# Altium project MB1428.PrjPcb (part 4 of 4)

## Sheet BUCK_BOOST_Converter.SchDoc: BUCK_BOOST_Converter
size A3; Date: Not used; ApprovedBy: Not used; CheckedBy: Not used; Author: Not used; CompanyName: STMicroelectronics; DrawnBy: Not used; Engineer: Not used; Organization: Not used; Address1: Not used; Address2: Not used; Address3: Not used; Address4: Not used; DocumentNumber: Not used; Revision: Not used; SheetNumber: 7; SheetTotal: 12; CurrentTime: Not used; CurrentDate: Not used; Time: Not used; DocumentFullPathAndName: Not used; DocumentName: Not used; ModifiedDate: Not used; ImagePath: Not used; ProjectName: Not used; Application_BuildNumber: Not used
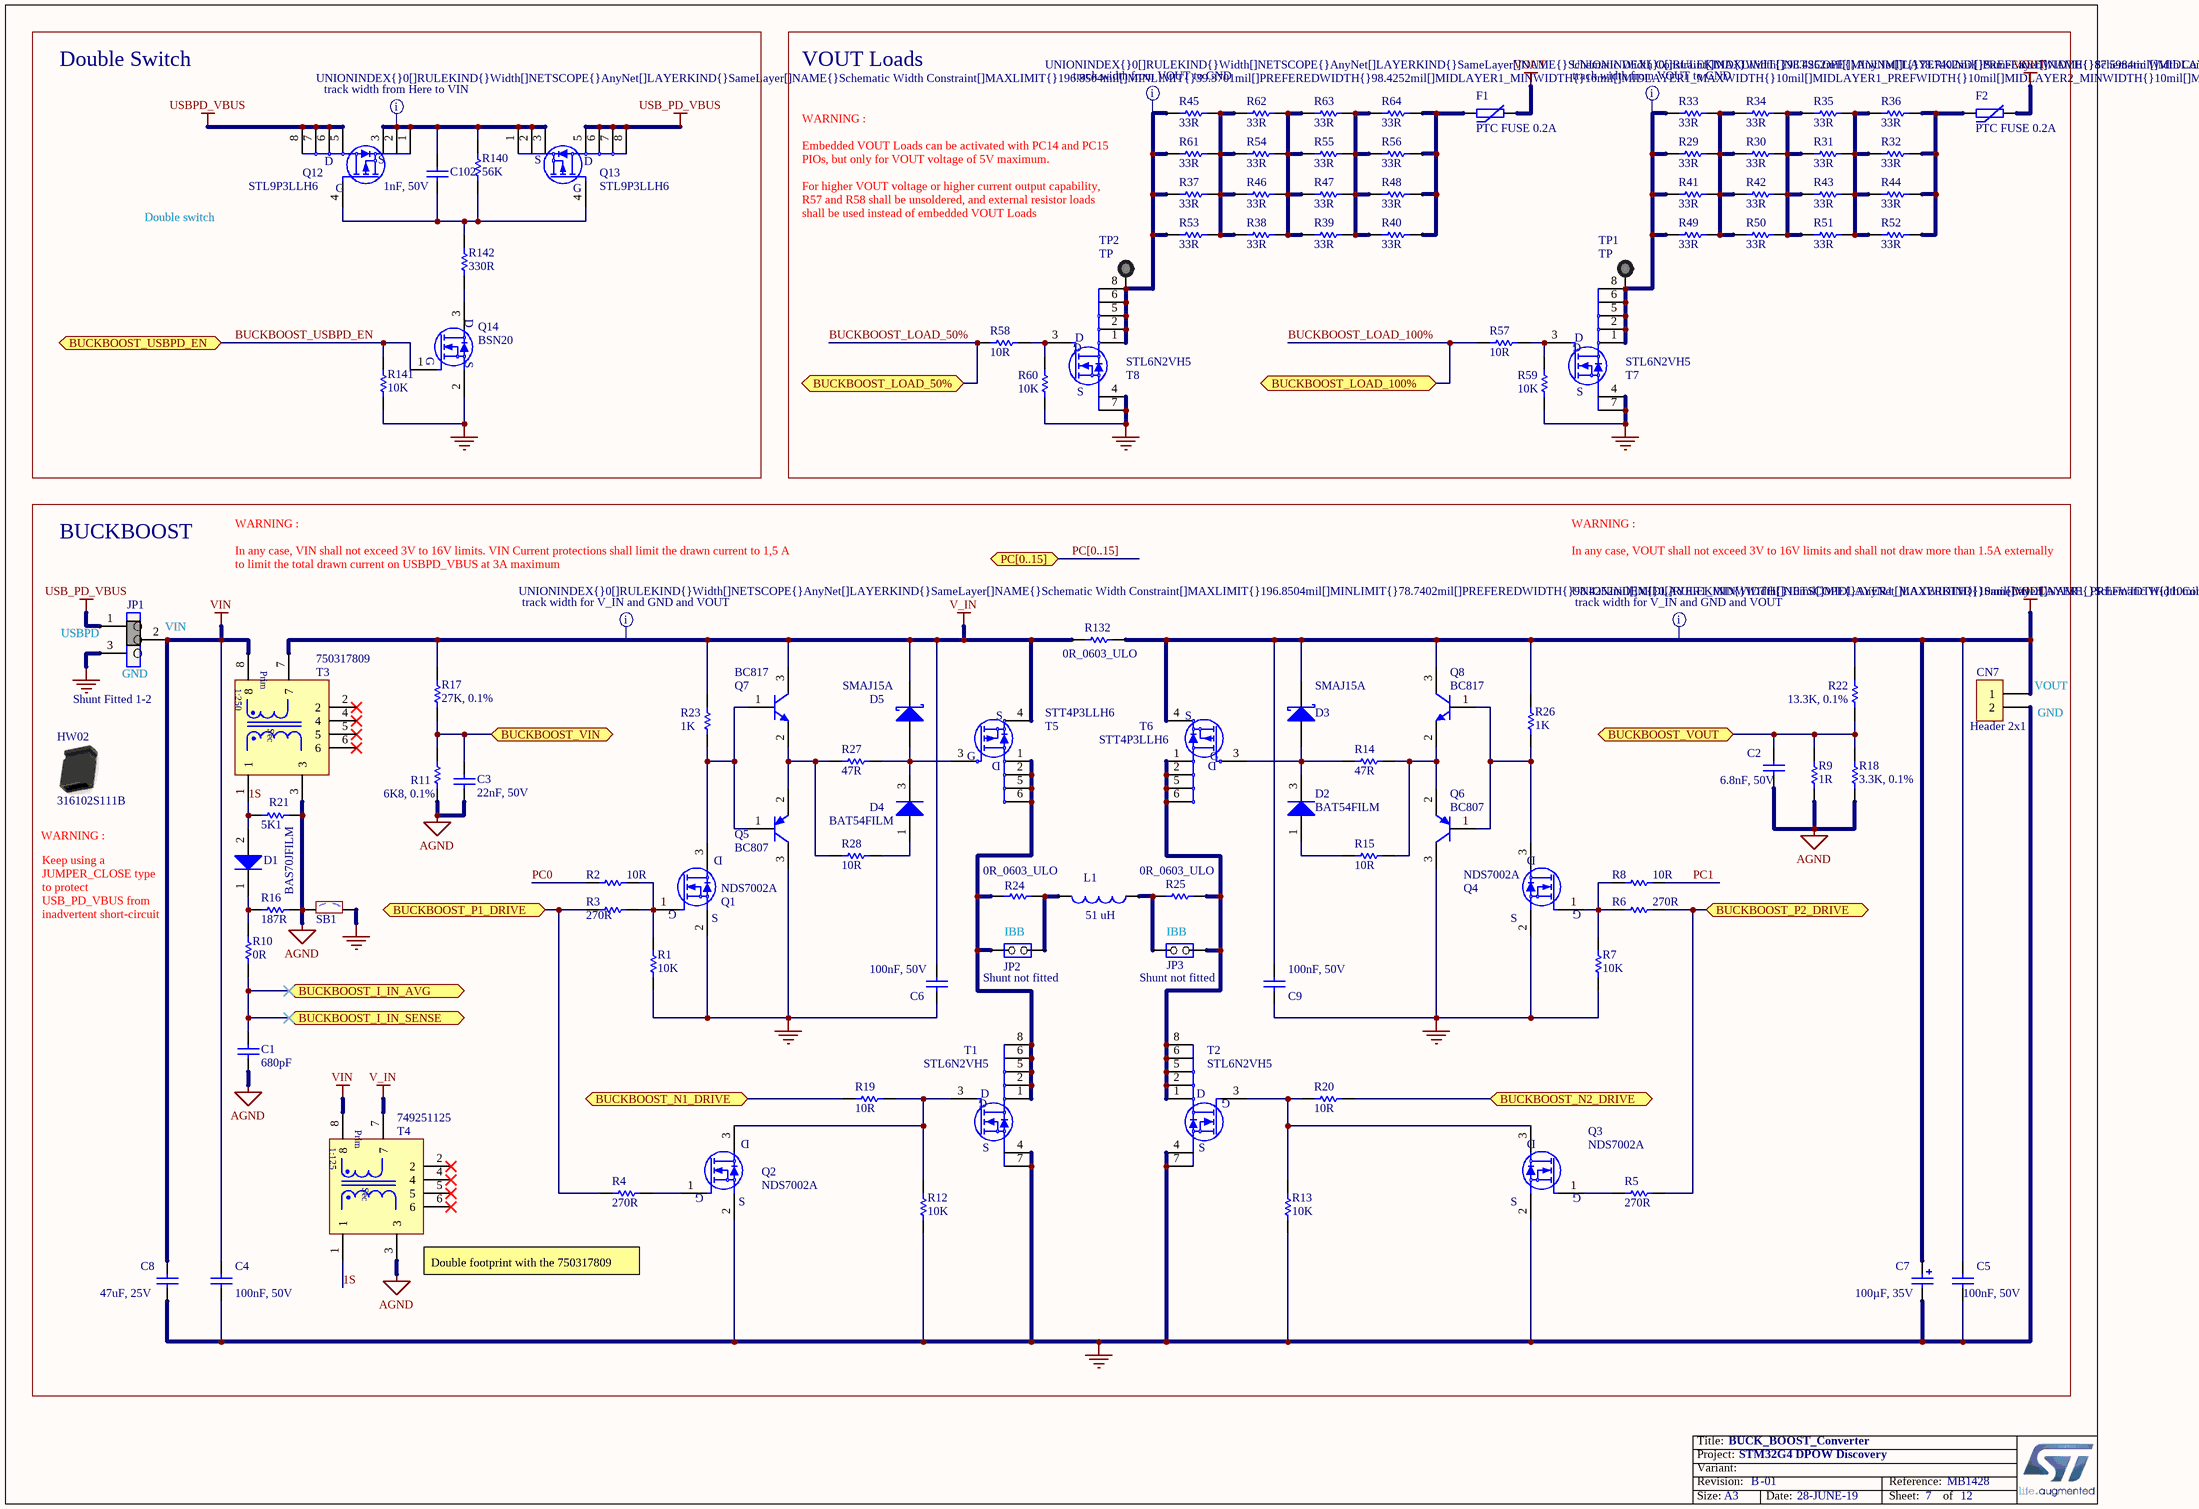
[diagram p10: BUCK_BOOST_Converter.SchDoc]

### Parts
C1  value 680pF  [C0603_H0P8]
C2  value 6.8nF, 50V  [C0603_H0P8]
C3  value 22nF, 50V  [C0603]
C4  value 100nF, 50V  [C0805_H0P85]
C5  value 100nF, 50V  [C0805_H0P85]
C6  value 100nF, 50V  [C0805_H0P85]
C7  value 100µF, 35V  [CPOL_WURTH_WCAP-ASLL_8X10P5]
C8  value 47uF, 25V  [C1206_H1P6]  (hidden comment: Capacitor)
C9  value 100nF, 50V  [C0805_H0P85]
C102  value 1nF, 50V  [C0805_H0P6]
CN7  Header 2x1  [CON_LYCONN_313102S141346]
D1  value BAS70JFILM  [DIO_SOD323_1K_2A]  (hidden comment: DIODE_1K_2A)
D2  value BAT54FILM  [DIO_SOT23_SC59_1A_2NC_3K_H1P4]
D3  value SMAJ15A  [DIO_SMA_1A_2K]
D4  value BAT54FILM  [DIO_SOT23_SC59_1A_2NC_3K_H1P4]
D5  value SMAJ15A  [DIO_SMA_1A_2K]
F1  value PTC FUSE 0.2A  [PTC_EATON_FUSE_PTS1812_H0P9]
F2  value PTC FUSE 0.2A  [PTC_EATON_FUSE_PTS1812_H0P9]
HW02  value 316102S111B  (hidden comment: JUMPER_CLOSE)
JP1  value Shunt Fitted 1-2  [CON_SAMTEC_TSW-103-07-F-S]  (hidden comment: Jumper_Header 3x1 Fitted 1-2)
JP2  value Shunt not fitted  [CON_988-JIUBABA_313102S111116]  (hidden comment: Jumper_Header 2x1)
JP3  value Shunt not fitted  [CON_988-JIUBABA_313102S111116]  (hidden comment: Jumper_Header 2x1)
L1  value 51 uH  [IND_SUNLORD_SWPA5040S]  (hidden comment: Inductor)
Q1  value NDS7002A  [ICC_SOT23-3L_H1P12]
Q2  value NDS7002A  [ICC_SOT23-3L_H1P12]
Q3  value NDS7002A  [ICC_SOT23-3L_H1P12]
Q4  value NDS7002A  [ICC_SOT23-3L_H1P12]
Q5  value BC807  [ICC_SOT23-3L_H1P12]
Q6  value BC807  [ICC_SOT23-3L_H1P12]
Q7  value BC817  [NPN_SOT23]
Q8  value BC817  [NPN_SOT23]
Q12  value STL9P3LLH6  [MOS_POWERFLAT_3P3X3P3_P065]
Q13  value STL9P3LLH6  [MOS_POWERFLAT_3P3X3P3_P065]
Q14  value BSN20  [MOS_SOT23]
R1  value 10K  [R0805]
R2  value 10R  [R0805_H0P5]
R3  value 270R  [R0805_H0P5]
R4  value 270R  [R0805_H0P5]
R5  value 270R  [R0805_H0P5]
R6  value 270R  [R0805_H0P5]
R7  value 10K  [R0805]
R8  value 10R  [R0805_H0P5]
R9  value 1R  [R1206_H0P55]
R10  value 0R  [R0603]  (hidden comment: Resistor)
R11  value 6K8, 0.1%  [R0805]
R12  value 10K  [R0805]
R13  value 10K  [R0805]
R14  value 47R  [R0805_H0P5]
R15  value 10R  [R0805_H0P5]
R16  value 187R  [R1206_H0P55]  (hidden comment: Resistor)
R17  value 27K, 0.1%  [R0805]
R18  value 3.3K, 0.1%  [R0805]
R19  value 10R  [R0805_H0P5]
R20  value 10R  [R0805_H0P5]
R21  value 5K1  [R0603]  (hidden comment: Resistor)
R22  value 13.3K, 0.1%  [R0805]
R23  value 1K  [R0603]
R24  value 0R_0603_ULO  [R0603]
R25  value 0R_0603_ULO  [R0603]
R26  value 1K  [R0603]
R27  value 47R  [R0805_H0P5]
R28  value 10R  [R0805_H0P5]
R29  value 33R  [R1206_H0P55]
R30  value 33R  [R1206_H0P55]
R31  value 33R  [R1206_H0P55]
R32  value 33R  [R1206_H0P55]
R33  value 33R  [R1206_H0P55]
R34  value 33R  [R1206_H0P55]
R35  value 33R  [R1206_H0P55]
R36  value 33R  [R1206_H0P55]
R37  value 33R  [R1206_H0P55]
R38  value 33R  [R1206_H0P55]
R39  value 33R  [R1206_H0P55]
R40  value 33R  [R1206_H0P55]
R41  value 33R  [R1206_H0P55]
R42  value 33R  [R1206_H0P55]
R43  value 33R  [R1206_H0P55]
R44  value 33R  [R1206_H0P55]
R45  value 33R  [R1206_H0P55]
R46  value 33R  [R1206_H0P55]
R47  value 33R  [R1206_H0P55]
R48  value 33R  [R1206_H0P55]
R49  value 33R  [R1206_H0P55]
R50  value 33R  [R1206_H0P55]
R51  value 33R  [R1206_H0P55]
R52  value 33R  [R1206_H0P55]
R53  value 33R  [R1206_H0P55]
R54  value 33R  [R1206_H0P55]
R55  value 33R  [R1206_H0P55]
R56  value 33R  [R1206_H0P55]
R57  value 10R  [R0805_H0P5]
R58  value 10R  [R0805_H0P5]
R59  value 10K  [R0603]
R60  value 10K  [R0603]
R61  value 33R  [R1206_H0P55]
R62  value 33R  [R1206_H0P55]
R63  value 33R  [R1206_H0P55]
R64  value 33R  [R1206_H0P55]
R132  value 0R_0603_ULO  [R0603]
R140  value 56K  [R0603]
R141  value 10K  [R0603]
R142  value 330R  [R0603]
SB1  (no value)  [SOLDER-BRIDGE_R0603-0R]
T1  value STL6N2VH5  [MOS_POWERFLAT_2X2_P065]
T2  value STL6N2VH5  [MOS_POWERFLAT_2X2_P065]
T3  value 750317809  [TRS_WURTH_750317809]
T4  value 749251125  [TRS_WURTH_749251125]
T5  value STT4P3LLH6  [MOS_SOT23-6L]
T6  value STT4P3LLH6  [MOS_SOT23-6L]
T7  value STL6N2VH5  [MOS_POWERFLAT_2X2_P065]
T8  value STL6N2VH5  [MOS_POWERFLAT_2X2_P065]
TP1  value TP  [TP_PTH_1MM_2MM]
TP2  value TP  [TP_PTH_1MM_2MM]

### Blocks framed on the sheet
Double Switch: C102 Q12-Q14 R140-R142
VOUT Loads: F1 F2 R29-R64 T7 T8 TP1 TP2
BUCKBOOST: C1-C9 CN7 D1-D5 HW02 JP1-JP3 L1 Q1-Q8 R1-R28 R132 SB1 T1-T6

### Ports
BUCKBOOST_I_IN_AVG, BUCKBOOST_I_IN_SENSE, BUCKBOOST_LOAD_50%, BUCKBOOST_LOAD_100%, BUCKBOOST_N1_DRIVE, BUCKBOOST_N2_DRIVE, BUCKBOOST_P1_DRIVE, BUCKBOOST_P2_DRIVE, BUCKBOOST_USBPD_EN, BUCKBOOST_VIN, BUCKBOOST_VOUT, PC[0..15] (bidir)

### Nets
AGND: C1.1 C2.1 C3.1 R9.1 R11.1 R16.2 R18.1 R21.2 SB1.1 T3.3 T4.3
GND: C4.1 C5.1 C6.1 C7.2 C8.1 C9.1 CN7.2 JP1.3 Q1.2(S) Q2.2(S) Q3.2(S) Q4.2(S) Q5.3(C) Q6.3(C) Q14.2(S) R1.1 R7.1 R12.1 R13.1 R59.1 R60.1 R141.1 SB1.2 T1.4(S) T1.7(S) T2.4(S) T2.7(S) T7.4(S) T7.7(S) T8.4(S) T8.7(S)
USB_PD_VBUS: JP1.1 Q13.5(D) Q13.6(D) Q13.7(D) Q13.8(D)
USBPD_VBUS: Q12.5(D) Q12.6(D) Q12.7(D) Q12.8(D)
V_IN: C6.2 D5.2(K) Q7.3(C) R17.2 R23.2 R132.1 T3.7 T4.7 T5.4(S)
VIN: C4.2 C8.2 JP1.2 T3.8 T4.8
VOUT: C5.2 C7.1 C9.2 CN7.1 D3.2(K) F1.2 F2.2 Q8.3(C) R22.2 R26.2 R132.2 T6.4(S)
1S: D1.2(A) R21.1 T3.1 T4.1
BUCKBOOST_I_IN_AVG: C1.2 R10.1 ; port BUCKBOOST_I_IN_AVG, port BUCKBOOST_I_IN_SENSE
BUCKBOOST_LOAD_50%: R58.1 ; port BUCKBOOST_LOAD_50%
BUCKBOOST_LOAD_100%: R57.1 ; port BUCKBOOST_LOAD_100%
BUCKBOOST_N1_DRIVE: R19.1 ; port BUCKBOOST_N1_DRIVE
BUCKBOOST_N2_DRIVE: R20.2 ; port BUCKBOOST_N2_DRIVE
BUCKBOOST_P1_DRIVE: R3.1 R4.1 ; port BUCKBOOST_P1_DRIVE
BUCKBOOST_P2_DRIVE: R5.2 R6.2 ; port BUCKBOOST_P2_DRIVE
BUCKBOOST_USBPD_EN: Q14.1(G) R141.2 ; port BUCKBOOST_USBPD_EN
BUCKBOOST_VIN: C3.2 R11.2 R17.1 ; port BUCKBOOST_VIN
BUCKBOOST_VOUT: C2.2 R9.2 R18.2 R22.1 ; port BUCKBOOST_VOUT
PC0: R2.1
PC1: R8.2
NetC102_1: C102.1 Q12.4(G) Q13.4(G) R140.2 R142.2
NetC102_2: C102.2 Q12.1(S) Q12.2(S) Q12.3(S) Q13.1(S) Q13.2(S) Q13.3(S) R140.1
NetD1_1: D1.1(K) R10.2 R16.1
NetD2_1: D2.1(A) R15.1
NetD2_3: D2.3(K) D3.1(A) R14.1 T6.3(G)
NetD4_1: D4.1(A) R28.2
NetD4_3: D4.3(K) D5.1(A) R27.2 T5.3(G)
NetF1_1: F1.1 R40.2 R48.2 R56.2 R64.2
NetF2_1: F2.1 R32.2 R36.2 R44.2 R52.2
NetJP2_1: JP2.1(COMMON) R24.1 T1.1(D) T1.2(D) T1.5(D) T1.6(D) T1.8(D) T5.1(S) T5.2(S) T5.5(D) T5.6(D)
NetJP2_2: JP2.2(NO) L1.2 R24.2
NetJP3_1: JP3.1(COMMON) L1.1 R25.1
NetJP3_2: JP3.2(NO) R25.2 T2.1(D) T2.2(D) T2.5(D) T2.6(D) T2.8(D) T6.1(S) T6.2(S) T6.5(D) T6.6(D)
NetQ1_1: Q1.1(G) R1.2 R2.2 R3.2
NetQ1_3: Q1.3(D) Q5.1(B) Q7.1(B) R23.1
NetQ2_1: Q2.1(G) R4.2
NetQ2_3: Q2.3(D) R12.2 R19.2 T1.3(G)
NetQ3_1: Q3.1(G) R5.1
NetQ3_3: Q3.3(D) R13.2 R20.1 T2.3(G)
NetQ4_1: Q4.1(G) R6.1 R7.2 R8.1
NetQ4_3: Q4.3(D) Q6.1(B) Q8.1(B) R26.1
NetQ5_2: Q5.2(E) Q7.2(E) R27.1 R28.1
NetQ6_2: Q6.2(E) Q8.2(E) R14.2 R15.2
NetQ14_3: Q14.3(D) R142.1
NetR29_1: R29.1 R33.1 R41.1 R49.1 T7.1(D) T7.2(D) T7.5(D) T7.6(D) T7.8(D) TP1.1
NetR29_2: R29.2 R30.1 R33.2 R34.1 R41.2 R42.1 R49.2 R50.1
NetR30_2: R30.2 R31.1 R34.2 R35.1 R42.2 R43.1 R50.2 R51.1
NetR31_2: R31.2 R32.1 R35.2 R36.1 R43.2 R44.1 R51.2 R52.1
NetR37_1: R37.1 R45.1 R53.1 R61.1 T8.1(D) T8.2(D) T8.5(D) T8.6(D) T8.8(D) TP2.1
NetR37_2: R37.2 R38.1 R45.2 R46.1 R53.2 R54.1 R61.2 R62.1
NetR38_2: R38.2 R39.1 R46.2 R47.1 R54.2 R55.1 R62.2 R63.1
NetR39_2: R39.2 R40.1 R47.2 R48.1 R55.2 R56.1 R63.2 R64.1
NetR57_2: R57.2 R59.2 T7.3(G)
NetR58_2: R58.2 R60.2 T8.3(G)

Not connected (* = marked no-connect by the designer): T3 2* 4* 5* 6*; T4 2* 4* 5* 6*

### Buses and harness runs
bus PC[0..15] = port PC[0..15]

### Layout directives
rule Width Constraint [Pref Width = 2.5mm    Min Width = 1mm    Max Width = 5mm]: NetC102_2
rule Width Constraint [Pref Width = 2.225mm    Min Width = 2mm    Max Width = 2.5mm]: NetR29_1, NetR37_1
rule Width Constraint [Pref Width = 2.5mm    Min Width = 2mm    Max Width = 5mm]: V_IN, VOUT

### Notes on the sheet
- WARNING :
- Embedded VOUT Loads can be activated with PC14 and PC15
- PIOs, but only for VOUT voltage of 5V maximum.
- Double switch
- (near R37) For higher VOUT voltage or higher current output capability,
- (near R37) R57 and R58 shall be unsoldered, and external resistor loads
- shall be used instead of embedded VOUT Loads
- to limit the total drawn current on USBPD_VBUS at 3A maximum
- In any case, VIN shall not exceed 3V to 16V limits. VIN Current protections shall limit the drawn current to 1,5 A
- In any case, VOUT shall not exceed 3V to 16V limits and shall not draw more than 1.5A externally
- (near JP1) USBPD
- (near JP1) VIN
- (near JP1) GND
- (near CN7) VOUT
- (near CN7) GND
- Keep using a
- JUMPER_CLOSE type
- to protect
- USB_PD_VBUS from
- inadvertent short-circuit
- (near JP2) IBB
- (near JP3) IBB
- (near T4) Double footprint with the 750317809
- Title:
- Project:
- Size:
- Revision:
- Variant:
- A3
- -
- Date:
- Reference:
- Sheet:
- of
- (in symbol MCD-01570) Prim; 1:125; Sec
- (in symbol MCD-01596) Prim; 1:250; Sec

### Library data of the parts
C1 = MCD-01576: Capacitor, MLCC, 680pF, 16V, X7R, 10%, 0603, T=0.8mm; Manufacturer_Part_Number: CC0603KRX7R7BB681; Manufacturer: YAGEO; Provided_By: SUBCO; Internal_Part_Number: MCD-01576; Status: Footprint available; Part_Type: Capacitor; Package: C0603; ComponentLink1Description: Datasheet; ComponentLink1URL: http://tunmcdsvn.tun.st.com/Component_Datasheet_Library/Trunk/Capacitors/Yageo_Multilayer_Capacitor_X7R_series_100pF_to_22uF/YAGEO_MLCC_UPY-GPHC_X7R_6.3V-to-50V_18.pdf
C2 = MCD-01544: Capacitor, MLCC, 6.8nF, 50V, X7R, 10%, 0603, T=0.8mm; Manufacturer_Part_Number: CC0603KRX7R9BB682; Manufacturer: YAGEO; Provided_By: SUBCO; Internal_Part_Number: MCD-01544; Status: Footprint available; Part_Type: Capacitor; Package: C0603; ComponentLink1Description: Datasheet; ComponentLink1URL: http://tunmcdsvn.tun.st.com/Component_Datasheet_Library/Trunk/Capacitors/Yageo_Multilayer_Capacitor_X7R_series_100pF_to_22uF/Yageo_Mutilayer_Capacitor_X7R_100pF_to_22uF.pdf
C3 = MCD-01103: Capacitor,22nF,50V,X7R,10%,0603; Manufacturer_Part_Number: CC0603KRX7R9BB223; Manufacturer: YAGEO; Provided_By: SUBCO; Internal_Part_Number: MCD-01103; Status: Footprint available; Part_Type: Capacitor; Package: C0603; ComponentLink1Description: Datasheet; ComponentLink1URL: http://tunmcdsvn.tun.st.com/Component_Datasheet_Library/Trunk/Capacitors/Yageo_Multilayer_Capacitor_X7R_series_100pF_to_22uF/Yageo_Mutilayer_Capacitor_X7R_100pF_to_22uF.pdf
C4-C6 C9 = MCD-01525: Capacitor, MLCC, 100nF, 50V, X7R, 10%, 0805, T=0,85mm; Manufacturer_Part_Number: CC0805KRX7R9BB104; Manufacturer: YAGEO; Provided_By: SUBCO; Internal_Part_Number: MCD-01525; Status: Footprint available; Part_Type: Capacitor; Package: C0805; ComponentLink1Description: Datasheet; ComponentLink1URL: http://tunmcdsvn.tun.st.com/Component_Datasheet_Library/Trunk/Capacitors/Yageo_Multilayer_Capacitor_X7R_series_100pF_to_22uF/Yageo_Mutilayer_Capacitor_X7R_100pF_to_22uF.pdf
C7 = MCD-01683: Capacitor, Electrolytic, 100µF, 35V, 20%, SMT, D=8mm, T=10.5mm; Manufacturer_Part_Number: 865060553006; Manufacturer: WURTH ELEKTRONIK; Provided_By: SUBCO; Revision: July-2002: Re-released for DXP Platform.; Internal_Part_Number: MCD-01683; Status: Footprint available; Part_Type: Capacitor; ComponentLink1Description: Datasheet; ComponentLink1URL: http://tunmcdsvn.tun.st.com/Component_Datasheet_Library/Trunk/Capacitors/WURTH_ELEKTRONIC_Electrolytic_ASLL_Series/WURTH_ELEKTRONIC_ASLL-Series_100uF_865060553006.pdf
C8 = MCD-01517: Capacitor, MLCC, 47uF, 25V, X5R, 20%, 1206, T=1,6mm; Manufacturer_Part_Number: C3216X5R1E476M160AC; Manufacturer: TDK; ECCN_US: EAR99; ECCN_EU: NEC; Provided_By: SUBCO; Internal_Part_Number: MCD-01517; Status: NRND (Not Recommended for New Design); Part_Type: Capacitor; Package: C1206; ComponentLink1Description: Datasheet; ComponentLink1URL: http://tunmcdsvn.tun.st.com/Component_Datasheet_Library/Trunk/Capacitors/TDK_Capacitor_MCC_series/TDK_Capacitor_MCC_series.pdf
C102 = MCD-01549: Capacitor, MLCC, 1nF, 50V, X7R,10%, 0805, T=0,6mm; Manufacturer_Part_Number: CC0805KRX7R9BB102; Manufacturer: YAGEO; Provided_By: SUBCO; Internal_Part_Number: MCD-01549; Status: Footprint available; Part_Type: Capacitor; Package: C0805; ComponentLink1Description: Datasheet; ComponentLink1URL: http://tunmcdsvn.tun.st.com/Component_Datasheet_Library/Trunk/Capacitors/Yageo_Multilayer_Capacitor_X7R_series_100pF_to_22uF/Yageo_Mutilayer_Capacitor_X7R_100pF_to_22uF.pdf
CN7 = MCD-01855: Header 2x1, 2.54mm, VR, TH, height 5.84mm/7.50 mm, height total 15.84 mm; Part_Type: Connector; Manufacturer_Part_Number: 313102S1411584; Manufacturer: LYCONN; Provided_By: SUBCO; Internal_Part_Number: MCD-01855; Value: Header 2x1; Status: Footprint available; ComponentLink1Description: Datasheet; ComponentLink1URL: http://tunmcdsvn.tun.st.com/Component_Datasheet_Library/Trunk/Connectors/LYCONN_313102S1411584/LYCONN_313102S1411584.pdf; ECCN_US: n/a; ECCN_EU: n/a
D1 = MCD-01880: ultrafast and RF switching diode, VF = 0.41 V @ IF = 1mA; VR = 70V;; Manufacturer: STMICROELECTRONICS; Provided_By: SUBCO with ST control; Internal_Part_Number: MCD-01880; Status: Footprint available; Part_Type: Diode; Manufacturer_Part_Number: BAS70JFILM; Package: SOD-323; ComponentLink1Description: Datasheet; ComponentLink1URL: http://tunmcdsvn.tun.st.com/Component_Datasheet_Library/Trunk/Diodes/STM_SCHOTTKY_BAS70JFILM; ECCN_US: n/a; ECCN_EU: n/a
D2 D4 = MCD-01524: Single surface mount small signal schotky diode; Manufacturer: STMICROELECTRONICS; Provided_By: SUBCO with ST control; Internal_Part_Number: MCD-01524; Status: Footprint available; Part_Type: Diode; Manufacturer_Part_Number: BAT54FILM; Package: SOT-23; ComponentLink1Description: Datasheet; ComponentLink1URL: http://tunmcdsvn.tun.st.com/Component_Datasheet_Library/Trunk/Diodes/STM_SCHOTTKY_DOUBLE_BAT54SWFILM/STM_SCHOTTKY_DOUBLE_BAT54SWFILM.pdf
D3 D5 = MCD-01522: Transil unidirectional diode Vrm=15V, Vbr=16.7V(1mA), Vcl=32.5V(71A), SMA; Manufacturer_Part_Number: SMAJ15A-TR; Manufacturer: STMICROELECTRONICS; Provided_By: SUBCO with ST control; Internal_Part_Number: MCD-01522; Status: Footprint available; Part_Type: Diode; Package: SMA; ComponentLink1Description: Datasheet; ComponentLink1URL: http://tunmcdsvn.tun.st.com/Component_Datasheet_Library/Trunk/Diodes/STM_Diode_SMAJ58A-TR/STM_Diode_SMAJ58A-TR.pdf
F1 F2 = MCD-01682: SMD, PTC resettable fuse, IH:0.2A, IT:0.4A, Vdc_max:30V, Rmax:5 ohm; Part_Type: Misc; Manufacturer_Part_Number: PTS181230V020; Manufacturer: EATON; Provided_By: SUBCO; Internal_Part_Number: MCD-01682; Status: Footprint available; ComponentLink1Description: Datasheet; ComponentLink1URL: http://tunmcdsvn.tun.st.com/Component_Datasheet_Library/Trunk/Misc/EATON_FUSE_PTC_Bussmann_PTS1812_Series/EATON_FUSE_PTC_Bussmann_PTS1812_Series.pdf
HW02 = MCD-01864: Jumper, height 6.5 mm, Black, 2.54mm, 3A, 20 mohm, close; Part_Type: Mechanical; Manufacturer: JIUBABA; Provided_By: SUBCO; Internal_Part_Number: MCD-01864; Status: Footprint available; Manufacturer_Part_Number: 316102S111B; ComponentLink1Description: Datasheet; ComponentLink1URL: http://tunmcdsvn.tun.st.com/Component_Datasheet_Library/Trunk/Mechanical/JIUBABA_316102S111B_Jumper_close_2.54mm/JIUBABA_316102S111B_Jumper_close_2.54mm.pdf; ECCN_US: n/a; ECCN_EU: n/a
JP1 = MCD-00684: Header, 3x1, 2,54mm, VR, TH, Height 5.84mm/2.54mm - Shunt Fitted 1-2 by default; Part_Type: Connector; Manufacturer_Part_Number: TSW-103-07-F-S; Manufacturer: SAMTEC; Provided_By: SUBCO; Internal_Part_Number: MCD-00684; Status: Released; ComponentLink1Description: Datasheet; ComponentLink1URL: http://tunmcdsvn.tun.st.com/Component_Datasheet_Library/Trunk/Connectors/Samtec_TSW-HTSW-series
JP2 JP3 = MCD-01660: Header 2x1, 2.54mm, VR, TH, height 6 mm / 3 mm, total 11.6mm - Shunt not Fitted by default; Part_Type: Connector; Manufacturer_Part_Number: 313102S111116; Manufacturer: JIUBABA; Provided_By: SUBCO; Internal_Part_Number: MCD-01660; Status: Footprint available; ComponentLink1Description: Datasheet; ComponentLink1URL: http://tunmcdsvn.tun.st.com/Component_Datasheet_Library/Trunk/Connectors/JIUBABA_31XXX_2.54mm_L11.6mm/JIUBABA_31XXX_2.54mm_L11.6mm.pdf
L1 = MCD-01787: SMD Wire wound power inductor, 51uH, 20%, Isat 1.2A, 380mohm, 5.0x5.0x4.0mm; Manufacturer_Part_Number: SWPA5040S510MT; Manufacturer: SUNLORD; Provided_By: SUBCO; Internal_Part_Number: MCD-01787; Status: Footprint available; Part_Type: Inductor; ComponentLink1Description: Datasheet; ComponentLink1URL: http://tunmcdsvn.tun.st.com/Component_Datasheet_Library/Trunk/Inductors/SUNLORD_Power_Inductor_SWPA5040S-Series/SUNLORD_Power_Inductor_SWPA5040S-Series.pdf; ECCN_US: n/a; ECCN_EU: n/a
Q1-Q4 = MCD-01518: MOSFET, Single N-Channel , Vgs(th): 2.5V, Id: 280mA, Vds(max): 60V, Vgs(max): +/-20V, Rdson:3 ohm@Vgs=5V; Part_Type: IC; Manufacturer: ON SEMICONDUCTOR; Alternate_Manufacturer: FAIRCHILD; Provided_By: SUBCO; Internal_Part_Number: MCD-01518; Status: Footprint available; Manufacturer_Part_Number: NDS7002A; Alternate_Manufacturer_Part_Number: NDS7002A; Package: SOT23-3L; ComponentLink1Description: Datasheet; ComponentLink1URL: http://tunmcdsvn.tun.st.com/Component_Datasheet_Library/Trunk/IC/ON_SEMICONDUCTOR_MOSFET_NDS7002A/ON_SEMICONDUCTOR_MOSFET_NDS7002A.pdf
Q5 Q6 = MCD-01527: Transistor Bipolar PNP, 45V, 500mA, 100MHz, 300mW, SOT23-3; Part_Type: IC; Manufacturer: NEXPERIA; Alternate_Manufacturer: NXP; Provided_By: SUBCO; Revision: *; Internal_Part_Number: MCD-01527; Status: Footprint available; Manufacturer_Part_Number: BC807; Alternate_Manufacturer_Part_Number: BC807; Package: PNP_SOT23; ComponentLink1Description: Datasheet; ComponentLink1URL: http://tunmcdsvn.tun.st.com/Component_Datasheet_Library/Trunk/IC/NEXPERIA_Transistor_BC807/NEXPERIA_BC807_BC807W_BC327.pdf
Q7 Q8 = MCD-01526: Transistor Bipolar NPN, 45V, 500mA, 100MHz, 300mW, SOT23-3; Part_Type: IC; Manufacturer: NEXPERIA; Alternate_Manufacturer: NXP; Provided_By: SUBCO; Revision: *; Internal_Part_Number: MCD-01526; Status: Footprint available; Manufacturer_Part_Number: BC817; Alternate_Manufacturer_Part_Number: BC817; Package: SOT23-3; ComponentLink1Description: Datasheet; ComponentLink1URL: http://tunmcdsvn.tun.st.com/Component_Datasheet_Library/Trunk/IC/NEXPERIA_Transistor_BC817/NEXPERIA_BC817_BC817W_BC337.pdf
Q12 Q13 = MCD-01126: Power Mosfet, P-channel,VDS -30V,RDS 12mohm typ,ID -9A; Part_Type: IC; Manufacturer: STMICROELECTRONICS; Provided_By: SUBCO with ST control; Internal_Part_Number: MCD-01126; Status: Checked; Manufacturer_Part_Number: STL9P3LLH6; Package: PowerFLAT 3.3x3.3; ComponentLink1Description: Datasheet; ComponentLink1URL: http://tunmcdsvn.tun.st.com/Component_Datasheet_Library/Trunk/IC/STM_POWER_MOSFET_P_STL9P3LLH6
Q14 = MCD-00151: N-channel enhancement mode field-effect transistor; Part_Type: IC; Manufacturer: NXP; Provided_By: SUBCO; Internal_Part_Number: MCD-00151; Status: Released; Manufacturer_Part_Number: BSN20; ComponentLink1Description: Datasheet; ComponentLink1URL: http://tunmcdsvn.tun.st.com/Component_Datasheet_Library/Trunk/IC/NXP_Transistor_BSN20BK_SOT23
R1 R7 R12 R13 = MCD-01154: Resistor,10K,0805,1%,1/8W; Manufacturer_Part_Number: RC0805FR-0710KL; Manufacturer: YAGEO; Provided_By: SUBCO; Internal_Part_Number: MCD-01154; Status: Released; Part_Type: Resistor; Package: R0805; ComponentLink1Description: Datasheet; ComponentLink1URL: http://tunmcdsvn.tun.st.com/Component_Datasheet_Library/Trunk/Resistors/Yageo_Resistor_RC0805-series
R2 R8 R15 R19 R20 R28 R57 R58 = MCD-01548: Resistor,10R,0805,1%, 1/8W; Manufacturer_Part_Number: RC0805FR-0710RL; Manufacturer: YAGEO; Provided_By: SUBCO; Internal_Part_Number: MCD-01548; Status: Footprint available; Part_Type: Resistor; Package: R0805; ComponentLink1Description: Datasheet; ComponentLink1URL: http://tunmcdsvn.tun.st.com/Component_Datasheet_Library/Trunk/Resistors/Yageo_Resistor_RC0805-series/Yageo_Resistor_RC0805-series.pdf
R3-R6 = MCD-01537: Resistor,270R,0805,1%,1/8W; Manufacturer_Part_Number: RC0805FR-07270RL; Manufacturer: YAGEO; Provided_By: SUBCO; Internal_Part_Number: MCD-01537; Status: Footprint available; Part_Type: Resistor; Package: R0805; ComponentLink1Description: Datasheet; ComponentLink1URL: http://tunmcdsvn.tun.st.com/Component_Datasheet_Library/Trunk/Resistors/Yageo_Resistor_RC0805-series/Yageo_Resistor_RC0805-series.pdf
R9 = MCD-01546: Resistor, 1R, 1206, 0.1%, 1/4W; Manufacturer_Part_Number: RT1206BRD071RL; Manufacturer: YAGEO; Provided_By: SUBCO; Internal_Part_Number: MCD-01546; Status: Footprint available; Part_Type: Resistor; Package: R1206; ComponentLink1Description: Datasheet; ComponentLink1URL: http://tunmcdsvn.tun.st.com/Component_Datasheet_Library/Trunk/Resistors/YAGEO_Resistor_RT_series_High_Precision/YAGEO_Resistor_RT_series_High_Precision_1-to-0.01_RoHS_L_9.pdf
R10 = MCD-00056: Resistor,0R,0603,5%,1/10W; Manufacturer_Part_Number: RC0603JR-070RL; Manufacturer: YAGEO; ECCN_US: EAR99; ECCN_EU: NEC; Provided_By: SUBCO; Internal_Part_Number: MCD-00056; Status: Released; Part_Type: Resistor; Package: R0603; ComponentLink1Description: Datasheet; ComponentLink1URL: http://tunmcdsvn.tun.st.com/Component_Datasheet_Library/Trunk/Resistors/Yageo_Resistor_RC0603-series
R11 = MCD-01654: Resistor, 6K8, 0805, 0.1%, 1/8W, 50ppm; Manufacturer_Part_Number: AR05BTD6801; Manufacturer: VIKING; Provided_By: SUBCO; Internal_Part_Number: MCD-01654; Status: Footprint available; Part_Type: Resistor; Package: R0805; ComponentLink1Description: Datasheet; ComponentLink1URL: http://tunmcdsvn.tun.st.com/Component_Datasheet_Library/Trunk/Resistors/VIKING_AR-Series_High_Precision/Viking_AR-Series_High_Precision.pdf
R14 R27 = MCD-01547: Resistor,47R,0805,1%,1/8W; Manufacturer_Part_Number: RC0805FR-0747RL; Manufacturer: YAGEO; Provided_By: SUBCO; Internal_Part_Number: MCD-01547; Status: Footprint available; Part_Type: Resistor; Package: R0805; ComponentLink1Description: Datasheet; ComponentLink1URL: http://tunmcdsvn.tun.st.com/Component_Datasheet_Library/Trunk/Resistors/Yageo_Resistor_RC0805-series/Yageo_Resistor_RC0805-series.pdf
R16 = MCD-01881: Resistor,187R,1206,1%,1/4W; Manufacturer_Part_Number: RC1206FR-07187RL; Manufacturer: YAGEO; Provided_By: SUBCO; Internal_Part_Number: MCD-01881; Status: Footprint available; Part_Type: Resistor; Package: R1206; ComponentLink1Description: Datasheet; ComponentLink1URL: http://tunmcdsvn.tun.st.com/Component_Datasheet_Library/Trunk/Resistors/Yageo_Resistor_RC1206-series/Yageo_Resistor_RC1206-series.pdf; Order_Code_Digikey: n/a; Order_Code_Farnell: n/a; Order_Code_RS: n/a; ECCN_US: n/a; ECCN_EU: n/a
R17 = MCD-01652: Resistor, 27K, 0805, 0.1%, 1/8W, 50ppm; Manufacturer_Part_Number: AR05BTD2702; Manufacturer: VIKING; Provided_By: SUBCO; Internal_Part_Number: MCD-01652; Status: Footprint available; Part_Type: Resistor; Package: R0805; ComponentLink1Description: Datasheet; ComponentLink1URL: http://tunmcdsvn.tun.st.com/Component_Datasheet_Library/Trunk/Resistors/VIKING_AR-Series_High_Precision/Viking_AR-Series_High_Precision.pdf
R18 = MCD-01653: Resistor, 3K3, 0805, 0.1%, 1/8W, 50ppm; Manufacturer_Part_Number: AR05BTD3301; Manufacturer: VIKING; Provided_By: SUBCO; Internal_Part_Number: MCD-01653; Status: Footprint available; Part_Type: Resistor; Package: R0805; ComponentLink1Description: Datasheet; ComponentLink1URL: http://tunmcdsvn.tun.st.com/Component_Datasheet_Library/Trunk/Resistors/VIKING_AR-Series_High_Precision/Viking_AR-Series_High_Precision.pdf
R21 = MCD-01882: Resistor,5K1,0603,1%,1/10W; Manufacturer_Part_Number: RC0603FR-075K1L; Manufacturer: YAGEO; Provided_By: SUBCO; Internal_Part_Number: MCD-01882; Status: Footprint available; Part_Type: Resistor; Package: R0603; ComponentLink1Description: Datasheet; ComponentLink1URL: http://tunmcdsvn.tun.st.com/Component_Datasheet_Library/Trunk/Resistors/Yageo_Resistor_RC0603-series; ECCN_US: n/a; ECCN_EU: n/a
R22 = MCD-01649: Resistor, 13K3, 0805, 0.1%, 1/8W, 50ppm; Manufacturer_Part_Number: AR05BTD1332; Manufacturer: VIKING; Provided_By: SUBCO; Internal_Part_Number: MCD-01649; Status: Footprint available; Part_Type: Resistor; Package: R0805; ComponentLink1Description: Datasheet; ComponentLink1URL: http://tunmcdsvn.tun.st.com/Component_Datasheet_Library/Trunk/Resistors/VIKING_AR-Series_High_Precision/Viking_AR-Series_High_Precision.pdf
R23 R26 = MCD-00070: Resistor,1K,0603,1%,1/10W; Manufacturer_Part_Number: RC0603FR-071KL; Manufacturer: YAGEO; Provided_By: SUBCO; Internal_Part_Number: MCD-00070; Status: Released; Part_Type: Resistor; Package: R0603; ComponentLink1Description: Datasheet; ComponentLink1URL: http://tunmcdsvn.tun.st.com/Component_Datasheet_Library/Trunk/Resistors/Yageo_Resistor_RC0603-series
R24 R25 R132 = MCD-00181: Resistor,0R,0603,ULO; Manufacturer_Part_Number: PMR03EZPJ000; Manufacturer: ROHM; Provided_By: SUBCO; Internal_Part_Number: MCD-00181; Status: Released; Part_Type: Resistor; Package: R0603; ComponentLink1Description: Datasheet; ComponentLink1URL: http://tunmcdsvn.tun.st.com/Component_Datasheet_Library/Trunk/Resistors/ROHM_ULtra_low_Ohmic_Resistor_PMR10EZPJ000
R29-R56 R61-R64 = MCD-01681: Resistor,33R,1206,1%,1/4W; Manufacturer_Part_Number: RC1206FR-0733RL; Manufacturer: YAGEO; Provided_By: SUBCO; Internal_Part_Number: MCD-01681; Status: Footprint available; Part_Type: Resistor; Package: R1206; ComponentLink1Description: Datasheet; ComponentLink1URL: http://tunmcdsvn.tun.st.com/Component_Datasheet_Library/Trunk/Resistors/Yageo_Resistor_RC1206-series/Yageo_Resistor_RC1206-series.pdf
R59 R60 R141 = MCD-00220: Resistor,10K,0603,1%,1/10W; Manufacturer_Part_Number: RC0603FR-0710KL; Manufacturer: YAGEO; Provided_By: SUBCO; Internal_Part_Number: MCD-00220; Status: Released; Part_Type: Resistor; Package: R0603; ComponentLink1Description: Datasheet; ComponentLink1URL: http://tunmcdsvn.tun.st.com/Component_Datasheet_Library/Trunk/Resistors/Yageo_Resistor_RC0603-series
R140 = MCD-00494: Resistor,56K,0603,1%,1/10W; Manufacturer_Part_Number: RC0603FR-0756KL; Manufacturer: YAGEO; Provided_By: SUBCO; Internal_Part_Number: MCD-00494; Status: Released; Part_Type: Resistor; Package: R0603; ComponentLink1Description: Datasheet; ComponentLink1URL: http://tunmcdsvn.tun.st.com/Component_Datasheet_Library/Trunk/Resistors/Yageo_Resistor_RC0603-series
R142 = MCD-00197: Resistor,330R,0603,1%,1/10W; Manufacturer_Part_Number: RC0603FR-07330RL; Manufacturer: YAGEO; BMS_Part_Number: 9129729; Provided_By: SUBCO; Internal_Part_Number: MCD-00197; Status: Released; Part_Type: Resistor; Package: R0603; ComponentLink1Description: Datasheet; ComponentLink1URL: http://tunmcdsvn.tun.st.com/Component_Datasheet_Library/Trunk/Resistors/Yageo_Resistor_RC0603-series
SB1 = MCD-00072: Solder Bridge OFF; Part_Type: Mechanical; Manufacturer_Part_Number: RC0603JR-070RL; Manufacturer: YAGEO; Provided_By: SUBCO; Internal_Part_Number: MCD-00072; Status: Released; Package: SB0603; ComponentLink1Description: Datasheet; ComponentLink1URL: http://tunmcdsvn.tun.st.com/Component_Datasheet_Library/Trunk/Resistors/Yageo_Resistor_RC0603-series
T1 T2 T7 T8 = MCD-01028: N-channel 20 V, 0.025 O typ., 6 A STripFET™ V Power MOSFET in a PowerFLAT™ 2x2 package; Part_Type: IC; Manufacturer: STMICROELECTRONICS; BMS_Part_Number: 9153558; Provided_By: SUBCO with ST control; Internal_Part_Number: MCD-01028; Status: Checked; Manufacturer_Part_Number: STL6N2VH5; Package: PowerFLAT 2x2; ComponentLink1Description: Datasheet; ComponentLink1URL: http://tunmcdsvn.tun.st.com/Component_Datasheet_Library/Trunk/IC/STM_POWER_MOSFET_N_STL6N2VH5
T3 = MCD-01596: Current Sense Transformer, 1:250 ratio, xx mohm / 20 ohms, 11mH, 10A; Part_Type: Inductor; Manufacturer: WURTH ELEKTRONIK; Provided_By: SUBCO; Internal_Part_Number: MCD-01596; Status: Footprint available; Manufacturer_Part_Number: 750317809; ComponentLink1Description: Datasheet; ComponentLink1URL: http://tunmcdsvn.tun.st.com/Component_Datasheet_Library/Trunk/IC/WURTH_Current_Sense_Transformer_750317809/WURTH_Current_Sense_Transformer_750317809.pdf
T4 = MCD-01570: Current Sense Transformer, 1:125 ratio, 6 mohm / 6.5 ohms, 3mH, 10A; Part_Type: IC; Manufacturer: WURTH ELEKTRONIK; Provided_By: SUBCO; Internal_Part_Number: MCD-01570; Status: Footprint available; Manufacturer_Part_Number: 749251125; ComponentLink1Description: Datasheet; ComponentLink1URL: http://tunmcdsvn.tun.st.com/Component_Datasheet_Library/Trunk/IC/WURTH_Current_Sense_Transformer_749251125/WURTH_Current_Sense_Transformer_749251125.pdf
T5 T6 = MCD-00574: Power MOSFET - P-Channel 30 V, 0.048 ? typ., 4 A STripFET H6 DeepGATE - SOT23-6L; Part_Type: IC; Manufacturer: STMICROELECTRONICS; Alternate_Manufacturer_Part_Number: STT7P2UH7; BMS_Part_Number: 9153046; Provided_By: SUBCO with ST control; Internal_Part_Number: MCD-00574; Status: Footprint available; Manufacturer_Part_Number: STT4P3LLH6; Alternate_Manufacturer: STMICROELECTRONICS; ComponentLink1Description: Datasheet; ComponentLink1URL: http://tunmcdsvn.tun.st.com/Component_Datasheet_Library/Trunk/IC/STM_POWER_MOSFET_STT4P3LLH6
TP1 TP2 = MCD-01506: Test Point trought hole 1mm/2mm; Part_Type: Mechanical; Internal_Part_Number: MCD-01506; Status: Released; Manufacturer_Part_Number: n/a; Manufacturer: n/a; ComponentLink1Description: Datasheet; ComponentLink1URL: n/a; Provided_By: n/a

## Nets that join several sheets
3V3: Power (6 pins), STM32_microcontroller_power (SB22.1), ST_LINK_V3E (CN1.3 R127.2)
3V3_OUT: Extension_connectors (CN8.1), Power (SB30.2)
5V: Power (10 pins), STM32_microcontroller_power (Q11.3 R137.2), ST_LINK_V3E (R125.1), RGB_LED_BUCK_Converters (R133.1)
5V_OUT: Extension_connectors (CN9.3), Power (C97.2 C98.2 C99.2 SB38.2)
5V_USB_CHGR: Power (JP5.7), ST_LINK_V3E (8 pins)
5V_USB_STLK: Power (JP5.1), ST_LINK_V3E (C69.2 U10.1)
5V_USBPD: Power (C103.2 C104.2 JP5.5), ST_LINK_V3E (SB31.1), USB_PD_TYPE-C (5 pins)
5V_VIN: Extension_connectors (CN9.1), Power (C100.2 C101.2 JP5.3), ST_LINK_V3E (D9.1)
AGND: Extension_connectors (CN8.4), STM32_microcontroller_power (13 pins), USB_PD_TYPE-C (C88.1 U16.2), RGB_LED_BUCK_Converters (C22.1 C90.1 C91.1), BUCK_BOOST_Converter (11 pins)
AVDD: Extension_connectors (CN8.7), STM32_microcontroller_power (C29.2 C31.2 L6.2 U3.29), USB_PD_TYPE-C (C88.2 U16.5)
GND: Extension_connectors (8 pins), Power (15 pins), STM32_microcontroller_IOs (23 pins), STM32_microcontroller_power (13 pins), ST_LINK_V3E (104 pins), USB_PD_TYPE-C (37 pins), RGB_LED_BUCK_Converters (11 pins), BUCK_BOOST_Converter (31 pins)
USBPD_VBUS: USB_PD_TYPE-C (12 pins), BUCK_BOOST_Converter (Q12.5 Q12.6 Q12.7 Q12.8)
VDD: Extension_connectors (CN8.3), Power (JP4.2), STM32_microcontroller_power (11 pins)
VREF: Extension_connectors (CN8.5), STM32_microcontroller_power (6 pins)
VREFP: Extension_connectors (CN8.6), STM32_microcontroller_power (C27.2 C28.1 L5.2 U3.28)
5V_USBPD_1A_PROTECT: STM32_microcontroller_IOs (SB20.1), USB_PD_TYPE-C (Q10.1 R103.2)
BUCK_BLUE_DRIVE: Extension_connectors (CN9.4), STM32_microcontroller_IOs (U3.42), RGB_LED_BUCK_Converters (R74.1)
BUCK_BLUE_DRIVE_Tiny: Extension_connectors (CN8.8), STM32_microcontroller_IOs (U3.41), RGB_LED_BUCK_Converters (R75.1)
BUCK_BLUE_SENSE: Extension_connectors (CN8.20), STM32_microcontroller_IOs (U3.24), RGB_LED_BUCK_Converters (C19.2 C91.2 R79.2)
BUCK_GREEN_DRIVE: Extension_connectors (CN8.9), STM32_microcontroller_IOs (U3.40), RGB_LED_BUCK_Converters (R72.1)
BUCK_GREEN_SENSE: Extension_connectors (CN8.30), STM32_microcontroller_IOs (SB13.2 U3.12), RGB_LED_BUCK_Converters (C18.2 C22.2 R78.2)
BUCK_RED_DRIVE: Extension_connectors (CN8.11), STM32_microcontroller_IOs (U3.38), RGB_LED_BUCK_Converters (R65.1)
BUCK_RED_SENSE: Extension_connectors (CN8.23), STM32_microcontroller_IOs (U3.21), RGB_LED_BUCK_Converters (C14.2 C90.2 R69.2)
BUCKBOOST_I_IN_AVG: STM32_microcontroller_IOs (SB13.1 SB14.1 SB26.2), BUCK_BOOST_Converter (C1.2 R10.1)
BUCKBOOST_LOAD_50%: Extension_connectors (CN9.24), STM32_microcontroller_IOs (U3.3), BUCK_BOOST_Converter (R58.1)
BUCKBOOST_LOAD_100%: Extension_connectors (CN9.25), STM32_microcontroller_IOs (U3.4), BUCK_BOOST_Converter (R57.1)
BUCKBOOST_N1_DRIVE: Extension_connectors (CN8.14), STM32_microcontroller_IOs (U3.35), BUCK_BOOST_Converter (R19.1)
BUCKBOOST_N2_DRIVE: Extension_connectors (CN8.13), STM32_microcontroller_IOs (U3.36), BUCK_BOOST_Converter (R20.2)
BUCKBOOST_P1_DRIVE: Extension_connectors (CN8.15), STM32_microcontroller_IOs (U3.34), BUCK_BOOST_Converter (R3.1 R4.1)
BUCKBOOST_P2_DRIVE: Extension_connectors (CN8.12), STM32_microcontroller_IOs (U3.37), BUCK_BOOST_Converter (R5.2 R6.2)
BUCKBOOST_USBPD_EN: STM32_microcontroller_IOs (SB12.1), BUCK_BOOST_Converter (Q14.1 R141.2)
BUCKBOOST_VIN: Extension_connectors (CN8.29), STM32_microcontroller_IOs (U3.13), BUCK_BOOST_Converter (C3.2 R11.2 R17.1)
BUCKBOOST_VOUT: Extension_connectors (CN8.27), STM32_microcontroller_IOs (U3.17), BUCK_BOOST_Converter (C2.2 R9.2 R18.2 R22.1)
D_N: STM32_microcontroller_IOs (R96.1), USB_PD_TYPE-C (CN2.A7 CN2.B7 U11.3 U11.4)
D_P: STM32_microcontroller_IOs (R95.1), USB_PD_TYPE-C (CN2.A6 CN2.B6 U11.1 U11.6)
MCO: STM32_microcontroller_IOs (SB36.1), ST_LINK_V3E (C84.2 R130.2)
PA2: Extension_connectors (CN8.28), STM32_microcontroller_IOs (SB14.2 U3.14)
PA4: Extension_connectors (CN8.26), STM32_microcontroller_IOs (U3.18)
PA5: Extension_connectors (CN8.25), STM32_microcontroller_IOs (U3.19)
PA6: Extension_connectors (CN8.24), STM32_microcontroller_IOs (U3.20)
PA9: Extension_connectors (CN9.5), STM32_microcontroller_IOs (R94.2 U3.43)
PA10: Extension_connectors (CN9.6), STM32_microcontroller_IOs (R93.2 U3.44)
PA11: Extension_connectors (CN9.7), STM32_microcontroller_IOs (R91.1)
PA12: Extension_connectors (CN9.8), STM32_microcontroller_IOs (R90.1)
PA13: Extension_connectors (CN9.9), STM32_microcontroller_IOs (SB29.2 U3.49)
PA14: Extension_connectors (CN9.10), STM32_microcontroller_IOs (SB27.2 U3.50)
PA15: Extension_connectors (CN9.11), STM32_microcontroller_IOs (R88.1 R89.1 SB28.2)
PB1: Extension_connectors (CN8.19), STM32_microcontroller_IOs (R80.2 U3.25)
PB2: Extension_connectors (CN8.18), STM32_microcontroller_IOs (SB3.2 U3.26)
PB3: Extension_connectors (CN9.16), STM32_microcontroller_IOs (SB16.1 U3.56)
PB4: Extension_connectors (CN9.17), STM32_microcontroller_IOs (R87.2)
PB5: Extension_connectors (CN9.18), STM32_microcontroller_IOs (R82.2 U3.58)
PB6: Extension_connectors (CN9.19), STM32_microcontroller_IOs (R84.2)
PB7: Extension_connectors (CN9.20), STM32_microcontroller_IOs (R81.2 U3.60)
PB8: Extension_connectors (CN9.21), STM32_microcontroller_IOs (R83.2 U3.61)
PB9: Extension_connectors (CN9.22), STM32_microcontroller_IOs (U3.62)
PB10: Extension_connectors (CN8.17), STM32_microcontroller_IOs (SB4.2 U3.30)
PB11: Extension_connectors (CN8.16), STM32_microcontroller_IOs (SB26.1 U3.33)
PC0: Extension_connectors (CN9.28), STM32_microcontroller_IOs (U3.8), BUCK_BOOST_Converter (R2.1)
PC1: Extension_connectors (CN9.29), STM32_microcontroller_IOs (U3.9), BUCK_BOOST_Converter (R8.2)
PC2: Extension_connectors (CN9.31), STM32_microcontroller_IOs (SB33.2 U3.10)
PC3: Extension_connectors (CN8.31), STM32_microcontroller_IOs (SB12.2 U3.11)
PC4: Extension_connectors (CN8.22), STM32_microcontroller_IOs (SB2.2 U3.22)
PC5: Extension_connectors (CN8.21), STM32_microcontroller_IOs (SB6.1 U3.23)
PC7: Extension_connectors (CN8.10), STM32_microcontroller_IOs (R97.1 U3.39)
PC10: Extension_connectors (CN9.12), STM32_microcontroller_IOs (SB24.2 U3.52)
PC11: Extension_connectors (CN9.13), STM32_microcontroller_IOs (SB23.2 U3.53)
PC12: Extension_connectors (CN9.14), STM32_microcontroller_IOs (SB20.2 U3.54)
PC13: Extension_connectors (CN9.23), STM32_microcontroller_IOs (SB5.1 U3.2)
PD2: Extension_connectors (CN9.15), STM32_microcontroller_IOs (SB19.1 U3.55)
PF0: Extension_connectors (CN9.26), STM32_microcontroller_IOs (SB10.1)
PF1: Extension_connectors (CN9.27), STM32_microcontroller_IOs (SB11.1)
T_JTDI: STM32_microcontroller_IOs (SB28.1), ST_LINK_V3E (CN1.10 U8.1)
T_NRST: Extension_connectors (CN9.30), STM32_microcontroller_IOs (C16.2 R67.1 U2.1 U3.7), ST_LINK_V3E (CN1.12 CN10.10 R115.2 U7.1)
T_SWCLK: STM32_microcontroller_IOs (SB27.1), ST_LINK_V3E (CN1.6 CN10.4 R112.2 U8.4)
T_SWDIO: STM32_microcontroller_IOs (SB29.1), ST_LINK_V3E (CN1.4 CN10.2 R111.2 U8.5)
T_SWO: STM32_microcontroller_IOs (SB16.2), ST_LINK_V3E (CN1.8 CN10.6 R113.2 U8.3)
T_VCP_RX: STM32_microcontroller_IOs (SB23.1), ST_LINK_V3E (CN1.13 R105.2 U13.1)
T_VCP_TX: STM32_microcontroller_IOs (SB24.1), ST_LINK_V3E (CN1.14 R114.2 U13.3)
USBPD_550mA_PROTECT: STM32_microcontroller_IOs (SB19.2), USB_PD_TYPE-C (Q9.1 R98.2)
USBPD_CC1: STM32_microcontroller_IOs (R85.2 R94.1), USB_PD_TYPE-C (C38.2 CN2.A5 U18.1)
USBPD_CC2: STM32_microcontroller_IOs (R86.2 R93.1), USB_PD_TYPE-C (C37.2 CN2.B5 U18.2)
USBPD_VIN: STM32_microcontroller_IOs (SB33.1), USB_PD_TYPE-C (R134.2 U16.1)

## Assembly variants
G474RE: not fitted C1 C2 C34 C84 C92 C93 C102 CN4 CN10 HW9 JP2 JP3 L7 R2 R8 R9 R75 R83 R84 R87 R90 R91 R119 R132 T4 TP1 TP2 TP3 TP4 X2
G431RB: not fitted C1 C2 C3 C4 C5 C6 C7 C8 C9 C34 C41 C84 C92 C93 C102 CN4 CN7 CN10 D1 D2 D3 D4 D5 F1 F2 HW02 HW22 HW23 JP1 JP2 JP3 L1 L7 Q1 Q2 Q3 Q4 Q5 Q6 Q7 Q8 Q12 Q13 Q14 R1 R2 R3 R4 R5 R6 R7 R8 R9 R10 R11 R12 R13 R14 R15 R16 R17 R18 R19 R20 R21 R22 R23 R24 R25 R26 R27 R28 R29 R30 R31 R32 R33 R34 R35 R36 R37 R38 R39 R40 R41 R42 R43 R44 R45 R46 R47 R48 R49 R50 R51 R52 R53 R54 R55 R56 R57 R58 R59 R60 R61 R62 R63 R64 R74 R83 R84 R87 R90 R91 R97 R119 R132 R140 R141 R142 SB1 T1 T2 T3 T4 T5 T6 T7 T8 TP1 TP2 TP3 TP4 X2; alternate parts SB14 -> MCD-00072, SB12 -> MCD-00072, SB26 -> MCD-00072, SB13 -> MCD-00072